# Altium schematic sheet ESC_Schematic_0.SchDoc
size A
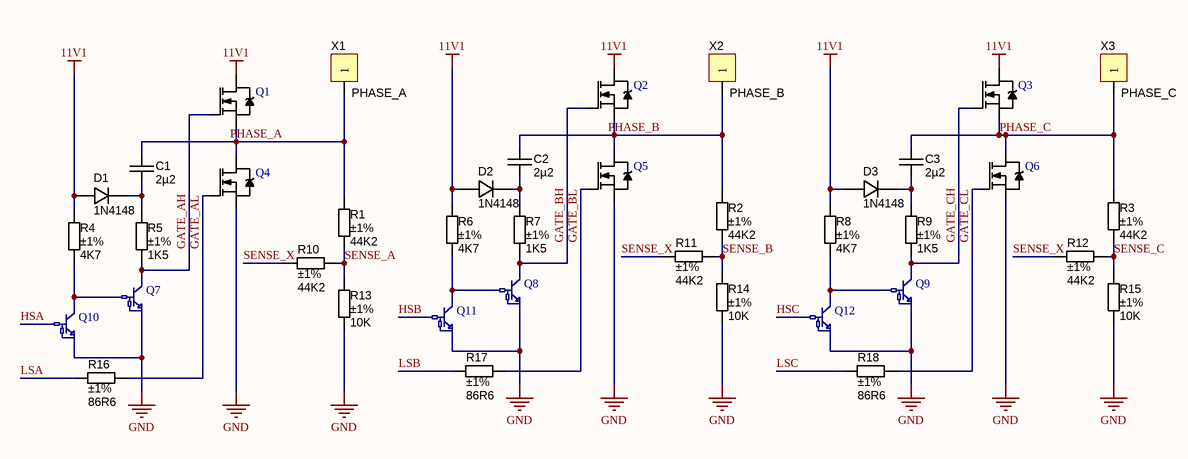
[diagram p0: ESC_Schematic_0.SchDoc]

## Parts
C1  value 2µ2  [CAPC2012X135N]  (hidden comment: approved sub OK)
C2  value 2µ2  [CAPC2012X135N]  (hidden comment: approved sub OK)
C3  value 2µ2  [CAPC2012X135N]  (hidden comment: approved sub OK)
D1  1N4148  [SOD523F]
D2  1N4148  [SOD523F]
D3  1N4148  [SOD523F]
Q1  *  [TO-252_1]  (value not drawn)
Q2  *  [TO-252_1]  (value not drawn)
Q3  *  [TO-252_1]  (value not drawn)
Q4  *  [TO-252_1]  (value not drawn)
Q5  *  [TO-252_1]  (value not drawn)
Q6  *  [TO-252_1]  (value not drawn)
Q7  *  [TO-236]  (value not drawn)
Q8  *  [TO-236]  (value not drawn)
Q9  *  [TO-236]  (value not drawn)
Q10  *  [TO-236]  (value not drawn)
Q11  *  [TO-236]  (value not drawn)
Q12  *  [TO-236]  (value not drawn)
R1  value 44K2  Tolerance: ±1%  [RESC2012X70N]  (hidden comment: Thick Film)
R2  value 44K2  Tolerance: ±1%  [RESC2012X70N]  (hidden comment: Thick Film)
R3  value 44K2  Tolerance: ±1%  [RESC2012X70N]  (hidden comment: Thick Film)
R4  value 4K7  Tolerance: ±1%  [RESC2012X70N]  (hidden comment: Thick Film)
R5  value 1K5  Tolerance: ±1%  [RESC2012X70N]  (hidden comment: Thick Film)
R6  value 4K7  Tolerance: ±1%  [RESC2012X70N]  (hidden comment: Thick Film)
R7  value 1K5  Tolerance: ±1%  [RESC2012X70N]  (hidden comment: Thick Film)
R8  value 4K7  Tolerance: ±1%  [RESC2012X70N]  (hidden comment: Thick Film)
R9  value 1K5  Tolerance: ±1%  [RESC2012X70N]  (hidden comment: Thick Film)
R10  value 44K2  Tolerance: ±1%  [RESC2012X70N]  (hidden comment: Thick Film)
R11  value 44K2  Tolerance: ±1%  [RESC2012X70N]  (hidden comment: Thick Film)
R12  value 44K2  Tolerance: ±1%  [RESC2012X70N]  (hidden comment: Thick Film)
R13  value 10K  Tolerance: ±1%  [RESC2012X70N]  (hidden comment: Thick Film)
R14  value 10K  Tolerance: ±1%  [RESC2012X70N]  (hidden comment: Thick Film)
R15  value 10K  Tolerance: ±1%  [RESC2012X70N]  (hidden comment: Thick Film)
R16  value 86R6  Tolerance: ±1%  [RESC2012X70N]  (hidden comment: Thick Film)
R17  value 86R6  Tolerance: ±1%  [RESC2012X70N]  (hidden comment: Thick Film)
R18  value 86R6  Tolerance: ±1%  [RESC2012X70N]  (hidden comment: Thick Film)
X1  PHASE_A  [THP_D38_T75_B125]  (no BOM)
X2  PHASE_B  [THP_D38_T75_B125]  (no BOM)
X3  PHASE_C  [THP_D38_T75_B125]  (no BOM)

## Nets
11V1: D1.A D2.A D3.A Q1.3(D) Q2.3(D) Q3.3(D) R4.1 R6.1 R8.1
GND: Q4.2(S) Q5.2(S) Q6.2(S) Q7.2(E) Q8.2(E) Q9.2(E) Q10.2(E) Q11.2(E) Q12.2(E) R13.2 R14.2 R15.2
GATE_AH: Q1.1(G) Q7.3(C) R5.2
GATE_AL: Q4.1(G) R16.2
GATE_BH: Q2.1(G) Q8.3(C) R7.2
GATE_BL: Q5.1(G) R17.2
GATE_CH: Q3.1(G) Q9.3(C) R9.2
GATE_CL: Q6.1(G) R18.2
HSA: Q10.1(B)
HSB: Q11.1(B)
HSC: Q12.1(B)
LSA: R16.1
LSB: R17.1
LSC: R18.1
PHASE_A: C1.1 Q1.2(S) Q4.3(D) R1.1 X1.1
PHASE_B: C2.1 Q2.2(S) Q5.3(D) R2.1 X2.1
PHASE_C: C3.1 Q3.2(S) Q6.3(D) R3.1 X3.1
SENSE_A: R1.2 R10.2 R13.1
SENSE_B: R2.2 R11.2 R14.1
SENSE_C: R3.2 R12.2 R15.1
SENSE_X: R10.1 R11.1 R12.1
NetC1_2: C1.2 D1.K R5.1
NetC2_2: C2.2 D2.K R7.1
NetC3_2: C3.2 D3.K R9.1
NetQ7_1: Q7.1(B) Q10.3(C) R4.2
NetQ8_1: Q8.1(B) Q11.3(C) R6.2
NetQ9_1: Q9.1(B) Q12.3(C) R8.2

## Library data of the parts
C1-C3 = CAPC_2u2_0805: Capacitor SMD Cer 2.2uF 10% 16V X7R 0805; Manufacturer 1: Kemet; Manufacturer Part Number 1: C0805C225K4RACTU; Ratings: 16V; X7R; SCDType: undef; Supplier 1: Digi-Key; Supplier Part Number 1: 399-3523-1-ND; Tolerance: ±10%; Package / Case: 0805 (2012 metric)
D1-D3 = DIODE_1N4148_200mA_SOD523F: Diode SMD small signal 0.2A SOD-523F; Manufacturer 1: Fairchild Semiconductor; Manufacturer Part Number 1: 1N4148WT; Ratings: Vr=75V; Vf=1V@10mA; Io=200mA; Material: Si; SCDType: source; Package / Case: SC-79, SOD-523F; Supplier 1: Digi-Key; Supplier Part Number 1: 1N4148WTCT-ND; ComponentLink1URL: http://www.fairchildsemi.com/ds/1N/1N914BWT.pdf; ComponentLink1Description: http://www.fairchildsemi.com/ds/1N/1N914BWT.pdf; Value: 1N4148
Q1-Q6 = PHD82N: PHD82N N-Channel MOSFET transistor
Q7-Q12 = PDTC143Z: NPN Resistor-Equipped Transistor (RET)
R1-R3 R10-R12 = RES_44K2_0805_1%: Resistor SMD chip 44.2k Ohm 0.125W 1% 0805; Manufacturer 1: Vishay/Dale; Manufacturer Part Number 1: CRCW080544K2FKEA; Ratings: 1/8W; SCDType: spec; Package / Case: 0805 (2012 metric); Supplier 1: Digi-Key; Supplier Part Number 1: 541-44.2KCCT-ND
R4 R6 R8 = RES_4K7_0805_1%: Resistor SMD chip 4.7k Ohm 0.125W 1% 0805; Manufacturer 1: Vishay/Dale; Manufacturer Part Number 1: CRCW08054K70FKEA; Ratings: 1/8W; SCDType: spec; Package / Case: 0805 (2012 metric); Supplier 1: Digi-Key; Supplier Part Number 1: 541-4.70KCCT-ND
R5 R7 R9 = RES_1K5_0805_1%: Resistor SMD chip 1.5k Ohm 0.125W 1% 0805; Manufacturer 1: Vishay/Dale; Manufacturer Part Number 1: CRCW08051K50FKEA; Ratings: 1/8W; SCDType: spec; Package / Case: 0805 (2012 metric); Supplier 1: Digi-Key; Supplier Part Number 1: 541-1.50KCCT-ND
R13-R15 = RES_10K_0805_1%: Resistor SMD chip 10k Ohm 0.125W 1% 0805; Manufacturer 1: Vishay/Dale; Manufacturer Part Number 1: CRCW080510K0FKEA; Ratings: 1/8W; SCDType: spec; Package / Case: 0805 (2012 metric); Supplier 1: Digi-Key; Supplier Part Number 1: 541-10.0KCCT-ND; Material: Thick Film
R16-R18 = RES_86R6_0805_1%: Resistor SMD chip 86.6 Ohm 0.125W 1% 0805; Manufacturer: Vishay/Dale; Manufacturer Part Number: CRCW080586R6FKEA; Ratings: 1/8W; SCDType: spec; Package / Case: 0805 (2012 metric); Supplier 1: Digi-Key; Supplier Part Number 1: 541-86.6CCT-ND
X1-X3 = Term1